# EAGLE design SmartSwitch_i2c (EAGLE 6.4)
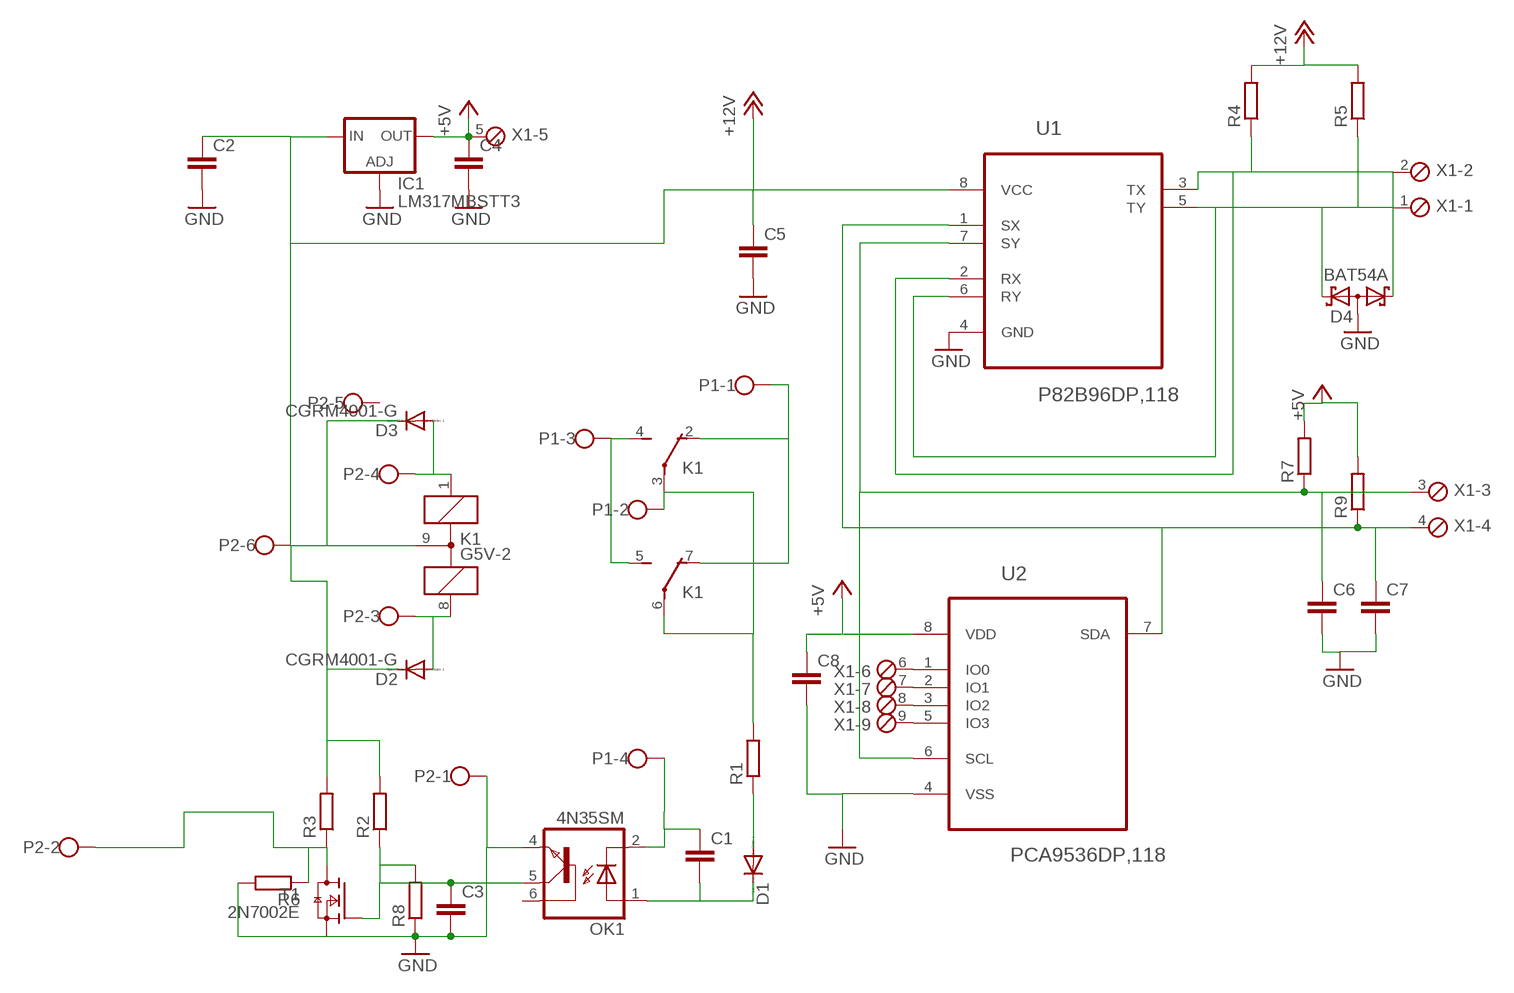
[diagram p0: schematic, sheet 1]

## Parts
C1  C-EUC0805K  [C0805K]
C2  C-EUC0805K  [C0805K]
C3  C-EUC0805K  [C0805K]
C4  C-EUC0805K  [C0805K]
C5  C-EUC0603K  [C0603K]
C6  C-EUC0402  [C0402]
C7  C-EUC0402  [C0402]
C8  C-EUC0603K  [C0603K]
D1  DIODE-DO-214AC  [DO-214AC]
D2  CGRM4001-G  [SOD-123_MINI-SMA]
D3  CGRM4001-G  [SOD-123_MINI-SMA]
D4  BAT54A  [SOT23]
IC1  LM317MBSTT3  [SOT223]
K1  G5V-2  [G5V-2]
OK1  4N35SM  [DIL6-SMD]
P1  W237-4  [W237-4]
P2  W237-6  [W237-6]
R1  R-EU_R1206  [R1206]
R2  R-EU_R0603  [R0603]
R3  R-EU_R0603  [R0603]
R4  R-EU_R1206  [R1206]
R5  R-EU_R1206  [R1206]
R6  R-EU_R0603  [R0603]
R7  R-EU_R0603  [R0603]
R8  R-EU_R0603  [R0603]
R9  R-EU_R0603  [R0603]
T1  2N7002E  [SOT23]
U1  P82B96DP,118  [SOP65P490X110-8N]
U2  PCA9536DP,118  [SOP65P490X110-8N]
X1  MPT9  [9POL254]

## Nets
+5V: C4.1 C8.1 IC1.4(OUT) R7.2 R9.2 U2.8(VDD) X1.5
+12V: C2.1 C5.1 D2.C D3.C IC1.3(IN) K1.9(M) P2.6 R2.2 R3.2 R4.2 R5.2 U1.8(VCC)
GND: C2.2 C3.2 C4.2 C5.2 C6.2 C7.2 C8.2 D4.3(A1A2) IC1.1(ADJ) OK1.4(EMI) P2.1 R6.2 R8.1 T1.2(S) U1.4(GND) U2.4(VSS)
HCL: D4.2(K2) R5.1 U1.5(TY) U1.6(RY) X1.1
HDA: D4.1(K1) R4.1 U1.2(RX) U1.3(TX) X1.2
N$1: K1.3(P) K1.6(P) P1.2 R1.2
N$2: K1.4(S) K1.5(S) P1.3
N$3: K1.2(O) K1.7(O) P1.1
N$12: D1.A R1.1
N$13: C1.2 D1.C OK1.1(A)
N$14: C1.1 OK1.2(C) P1.4
N$15: D3.A K1.1 P2.4
N$16: D2.A K1.8 P2.3
N$18: C3.1 OK1.5(COL) R2.1 R8.2 T1.1(G)
N$20: P2.2 R3.1 R6.1 T1.3(D)
N$32: U2.1(IO0) X1.6
N$33: U2.2(IO1) X1.7
N$34: U2.3(IO2) X1.8
N$35: U2.5(IO3) X1.9
SCL: C6.1 R7.1 U1.7(SY) U2.6(SCL) X1.3
SDA: C7.1 R9.1 U1.1(SX) U2.7(SDA) X1.4
Unconnected: OK1.6(BAS) P2.5

## Library data of the parts
C1-C4 = resistor:C-EU: CAPACITOR, European symbol
C5-C8 = billyInd:C-EU: CAPACITOR, European symbol
D1 = diode:DIODE-: DIODE
D2 D3 = diode:CGRM400*-G: Molded plasitc,JEDEC SOD-123/Mini SMA Source: Comchip CGRM4001-G.pdf
D4 = NXP_60_26022015:BAT54A: Schottky barrier (double) diodes Planar Schottky barrier diodes encapsulated in a SOT23 small plastic SMD package. Single diodes and double diodes with different pinning are available. AAL Eindhoven MK
IC1 = v-reg:LM317?*: 500 mA Adjustable Output Positive Voltage Regulator Source: http://www.onsemi.co.jp .. LM317M-D.PDF
K1 = relay_billy:G5V-2: OMRON PCB Relay Source: http://www.omron.com/ecb/products/pdf/en-g5v2.pdf; MPN: G5V-2 5DC; OC_FARNELL: 9949488; OC_NEWARK: 78K5703
OK1 = optocoupler:4N*?M: General Purpose 6-Pin Phototransistor Optocouplers Source: http://www.fairchildsemi.com/ds/4N/4N35-M.pdf; MF: FAIRCHILD SEMICONDUCTOR; MPN: 4N35S-M; OC_FARNELL: 1021179; OC_NEWARK: 67K2285
P1 = strip_connector_billy:W237-4: WAGO SCREW CLAMP; OC_FARNELL: unknown; OC_NEWARK: unknown
P2 = strip_connector_billy:W237-6: WAGO SCREW CLAMP; OC_FARNELL: unknown; OC_NEWARK: unknown
R1-R3 R6 R8 = resistor:R-EU_: RESISTOR, European symbol
R4 R5 R7 R9 = billyInd:R-EU_: RESISTOR, European symbol
T1 = NXP_60_26022015:2N7002: N-channel TrenchMOS FET N-channel enhancement mode Field-Effect Transistor (FET) in a plastic package using TrenchMOS technology. AAL Eindhoven MK
U1 = NXP_billy2:P82B96DP,118: Dual bidirectional bus buffer; MPN: P82B96DP,118; OC_FARNELL: 1831235; OC_NEWARK: 70R8458; PACKAGE: TSSOP-8; SUPPLIER: NXP Semiconductors
U2 = NXP_By_element14_Batch_1:PCA9536DP,118: 4-bit I2C-bus and SMBus I/O port; MPN: PCA9536DP,118; OC_FARNELL: -; OC_NEWARK: 70R6545; PACKAGE: TSSOP-8; SUPPLIER: NXP Semiconductors
X1 = con-phoenix-254:MPT9: PHOENIX CONNECTOR; OC_FARNELL: unknown; OC_NEWARK: unknown

## Board
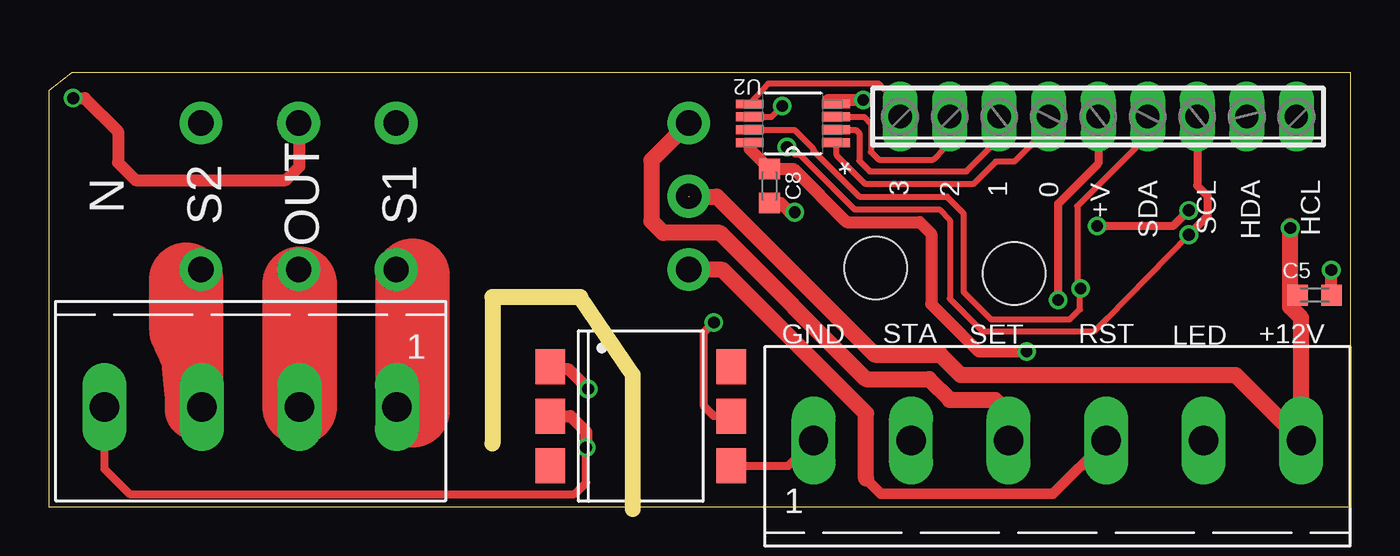
[diagram p1: board, top side]
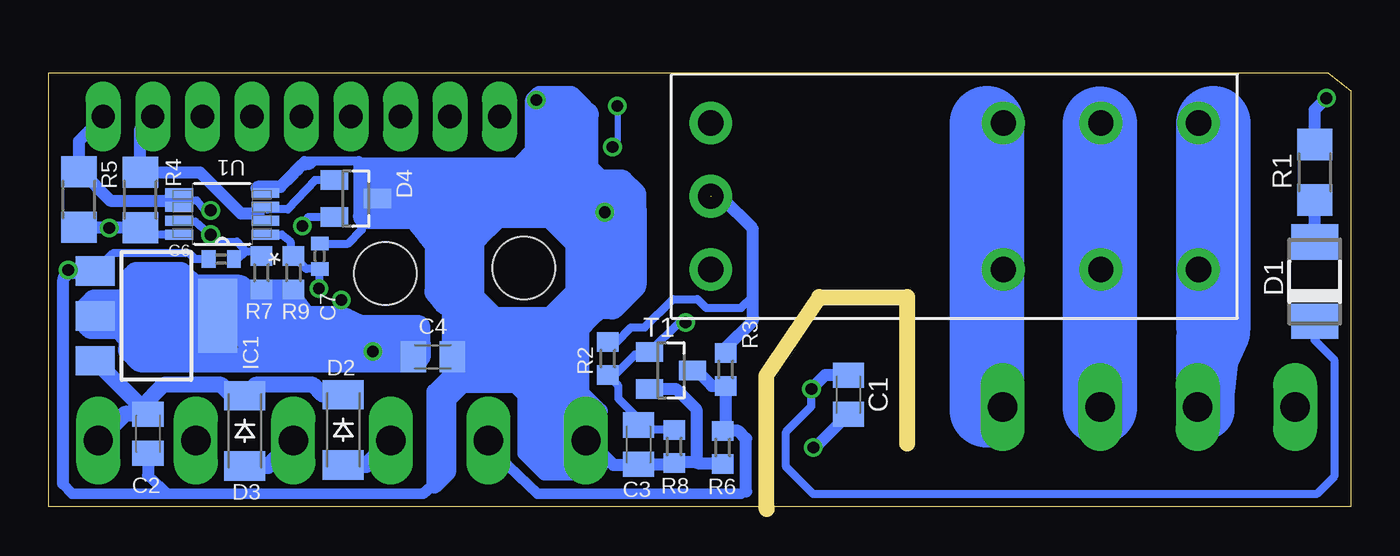
[diagram p2: board, bottom side, seen from below]

Size 66.75 x 22.25 mm. Coordinates in mm from the lower left corner, seen from the top.
Outline: 0,0 66.75,0 66.75,22.25 1.17,22.25 0,21.33 0,0
Copper layers (1*16): Top 0.0356mm / dielectric 1.5011mm / Bottom 0.0356mm
Design rules "LaenPCBOrder *": minimum track width 6mil, minimum drill 13mil, track to track 6mil, track to pad 6mil, pad to pad 6mil, via to via 6mil, smd to smd 6mil, copper to edge 15mil, drill to drill 6mil, minimum pad ring 7mil, minimum via ring 7mil, stop-mask expansion 4mil, vias tented up to drill 24mil, thermal gap 10mil
Holes 3.2 mm at 42.4,12.25 49.5,11.96
Milling: 4 lines

### Footprints (pad centres in the part's own frame; a part is rotated, then mirrored left to right if it is on the bottom)
C0805K = smd 1.3 x 1.6: 1 -1,0; 2 1,0
C0603K = smd 1.05 x 1.08: 1 -0.875,0; 2 0.875,0
C0402 = smd 0.7 x 0.9: 1 -0.65,0; 2 0.65,0
DO-214AC = smd 1.8 x 2.4: A 2.025,0; C -2.025,0
SOD-123_MINI-SMA = smd 1.5 x 2.1: A 1.8,0; C -1.8,0
SOT23 = smd 1 x 1.4: 1 -0.95,-1.1; 2 0.95,-1.1; 3 0,1.1
SOT223 = smd 1.5 x 2: 1 -2.3,-3.15; 2 0,-3.15; 3 2.3,-3.15 | smd 3.8 x 2: 4 0,3.15
G5V-2 = drill 1.3 pad 2.184: 1 0,-3.75; 2 15,-3.75; 3 20,-3.75; 4 25,-3.75; 5 25,3.75; 6 20,3.75; 7 15,3.75; 8 0,3.75; 9 0,0
DIL6-SMD = smd 1.78 x 1.52: 1 -2.54,-4.645; 2 0,-4.645; 3 2.54,-4.645; 4 2.54,4.645; 5 0,4.645; 6 -2.54,4.645
W237-4 = drill 1.5 long: 1 -7.5,-1.27; 2 -2.5,-1.27; 3 2.5,-1.27; 4 7.5,-1.27
W237-6 = drill 1.5 long: 1 -12.5,-1.27; 2 -7.5,-1.27; 3 -2.5,-1.27; 4 2.5,-1.27; 5 7.5,-1.27; 6 12.5,-1.27
R1206 = smd 1.6 x 1.803: 1 -1.422,0; 2 1.422,0
R0603 = smd 1 x 1.1: 1 -0.85,0; 2 0.85,0
SOP65P490X110-8N = smd 1.422 x 0.508: 1 -2.21,1.067; 2 -2.21,0.356; 3 -2.21,-0.356; 4 -2.21,-1.067; 5 2.21,-1.067; 6 2.21,-0.356; 7 2.21,0.356; 8 2.21,1.067
SOP65P490X110-8N' = smd 1.422 x 0.457: 1 -2.21,0.991; 2 -2.21,0.33; 3 -2.21,-0.33; 4 -2.21,-0.991; 5 2.21,-0.991; 6 2.21,-0.33; 7 2.21,0.33; 8 2.21,0.991
9POL254 = drill 1.2 long: 1 -10.16,0; 2 -7.62,0; 3 -5.08,0; 4 -2.54,0; 5 0,0; 6 2.54,0; 7 5.08,0; 8 7.62,0; 9 10.16,0

### Placement (x,y rotation side)
C1  25.75,5.75 90 bottom
C2  61.66,3.75 270 bottom
C3  36.51,3.19 270 bottom
C4  47.06,7.69 0 bottom
C5  64.9,10.86 0 top
C6  57.9,12.7 180 bottom
C7  52.86,12.85 90 bottom
C8  36.95,16.45 270 top
D1  1.85,11.55 90 bottom
D2  51.65,3.95 270 bottom
D3  56.7,3.9 270 bottom
D4  51.01,15.8 270 bottom
IC1  61.23,9.79 270 bottom
K1  32.81,15.92 0 bottom
OK1  30.35,4.65 270 top
P1  10.35,3.85 180 top
P2  51.71,4.67 0 top
R1  1.85,17.15 90 bottom
R2  38.1,7.6 90 bottom
R3  32.05,7.05 90 bottom
R4  62.05,15.73 270 bottom
R5  65.2,15.75 270 bottom
R6  32.2,3.05 270 bottom
R7  55.85,12 270 bottom
R8  34.69,3.1 90 bottom
R9  54.2,12 270 bottom
T1  34.85,7 270 bottom
U1  57.85,15.02 180 bottom
U2  PCA9536DP,118  [SOP65P490X110-8N']  38.15,19.66 180 top
X1  53.8,20 180 top

### Tracks (layer width: path | path; a pad name or v marks a point on that pad's centre or on a via)
+5V  (via drill 0.6)
  Top 0.406: X1.5 53.8,17.6 51.75,15.55 v51.75,10.6 | U2.8 35.94,18.48
  Top 0.61: 35.94,18.48 35.94,18.34 C8.1 38.17,17.32 40.9,14.6 44.65,14.6 45.25,14 45.25,10.4 47.69,7.96 v50.14,7.96
  Bottom 0.406: R9.2 R7.2 56.72,11.15 IC1.4 | 51.65,8.95 52.3,8.3 | v51.75,10.6 51.75,8.98 51.93,8.8
  Bottom 0.61: v50.14,7.96 53.3,8.3 | R9.2 54.45,11
  Bottom 0.813: C4.1 v50.14,7.96 52.3,8.3 53.3,8.3 56.59,8.3 IC1.4
  Bottom 1.27: 54.45,11 56.65,11 56.95,11.1 56.95,11.25 59.35,11.25 60,11.9 62.25,11.9 62.4,11.75 62.4,11 62.9,10.5 64.4,10.5 64.75,10.15 64.75,9.45 64.55,9.25 63.15,9.25 62.55,8.65 62.55,8.05 62.05,7.55 48,7.55 47.8,7.75 47.82,9.19 47.96,9.18 50.91,9.18 49.12,8.94 50.84,9.2 51.6,9.57 51.95,9.63 52.15,9.65 53.6,9.65 54.2,10.45 56.5,10.55 56.7,10.35 56.7,9.55 56.3,9.15 48.95,9.15 48.6,8.8 51.93,8.8 53.85,8.8 54.7,9.65 56.15,9.65 56.2,9.7 59.15,9.7 60.45,11 59.65,11 59.1,10.45 61.1,10.45 61.6,10.95 61.8,10.95 62.75,10 62.75,9.6 61.75,8.6 59.5,8.6 59.2,8.3 59.2,8.4 60.4,9.6 61.25,9.6 61.5,9.85
+12V  (via drill 0.6)  (1 unrouted)
  Top 0.61: v63.65,14.3 63.5,14.25 | C5.1 63.65,10.86 63.65,11.08
  Top 0.813: P2.6 64.21,3.59 | P2.6 64.21,9.69 63.65,10.25 63.65,11.08 v63.65,14.3 63.65,14.39 | 32.83,15.9 34.25,15.9 42.35,7.8 45.72,7.8 46.75,6.77 60.84,6.77 P2.6
  Bottom 0.406: R2.2 37.65,8.45 36.9,9.2 36.2,9.2 34.75,10.65 33.5,10.65 33.05,10.2 31.25,10.2 30.65,10.8 | U1.8 61.85,13.95 R4.2
  Bottom 0.61: R3.2 32.05,8.15 30.65,9.55 30.65,10.8 30.65,14.25 32.25,15.85 32.74,15.85 K1.9 | R5.2 63.43,14.33 v63.65,14.3 63.29,14.31 R4.2
  Bottom 0.813: C2.1 61.66,4.77 | 61.66,4.77 61.99,5.11 | 61.99,5.11 IC1.3 | 61.66,4.77 62.84,4.77 P2.6 | 61.99,5.11 60.85,6.25 57.9,6.25 57.35,5.7 D3.C 56.15,6.25 53.2,6.25 52.7,5.75 D2.C
GND  (via drill 0.6)
  Top 0.305: 39.95,20.85 40.61,20.9 U2.4
  Top 0.406: OK1.4 37.92,2.11 P2.1
  Top 0.61: C8.2 37.52,15.57 38,15.1 v38.25,15.1 | v41.75,20.85 39.95,20.85 | C5.2 65.75,10.86 v65.75,12.15
  Bottom 0.305: 47.3,14.05 47.31,14.7 48.53,15.21 | 53.75,17.53 53.85,17.53 53.86,17.54
  Bottom 0.406: C6.2 59.25,12.7 59.55,13 63.47,13 IC1.1 | 55.62,16.19 U1.4 56.01,16.35 56.1,16.35 | C7.2 51.4,13.5 50.7,14.2 50.7,14.86 | 50.7,14.86 50.69,14.87 | 50.69,14.87 50.61,14.95 D4.3 | 41.3,20.85 40.3,19.85 | 45.61,7.83 45.67,7.83 45.67,7.75 | 47.65,14.85 50.71,14.85 50.73,14.87 50.69,14.87 | 50.69,14.87 50.69,14.89 50.33,14.89 50.01,15.21 | 50.7,14.86 50.38,14.86 50.03,15.21 50.03,15.23 50.05,15.23 50.07,15.21 50.07,15.77 49.51,16.33 49.51,15.71 50.01,15.21 | 50.01,15.21 50.05,15.21 50.07,15.19 50.07,15.17 50.05,15.15
  Bottom 0.457: 49.95,16.7 50.85,17.75 53.65,17.75 53.86,17.54 54,17.4 54,17.28
  Bottom 0.55: 61.66,1.61 60.65,0.68 | 60.65,0.68 47.55,0.68 46.55,1.55 | 66.03,1.2 65.55,0.68 60.65,0.68
  Bottom 0.61: P2.1 39.05,3.4 37.8,2.15 36.55,2.15 C3.2 34.75,2.19 R8.1 34.64,2.3 33.55,2.3 | T1.2 34.6,6.05 33.55,5 33.55,2.3 | 33.55,2.3 33.5,2.25 32.25,2.25 R6.2 | C2.2 61.66,1.61 | 65.61,12.09 66,11.7 | 66.03,1.2 66.03,11.55 66,11.7 | v65.75,12.15 66,11.7 | 49.95,16.7 49.75,15.89 D4.3 | 56.1,16.35 56.05,16.4 54.88,16.4 54,17.28 | 54.56,16.72 53.75,17.53 53.45,17.58 53.34,17.63
  Bottom 0.813: 46.55,1.55 46.55,5.2 | 46.55,5.2 45.5,6.25 42.06,6.25 P2.1 | IC1.1 65.61,12.09 | 46.55,5.2 45.93,7.85 45.61,7.83 C4.2 45.05,9.94 | 49.75,15.89 48.53,15.21 46.9,13.2 | v41.75,20.85 41.3,20.85 | 42.33,6.29 42.33,2.77 41.33,1.77 38.83,1.77 38.51,2.09 38.51,4.91 39.45,5.85 39.45,4.11 39.11,3.77 39.11,2.63 39.01,2.53 41.05,2.53 41.17,2.41 40.25,2.41 39.65,3.01 39.65,8.91 38.69,9.87 38.69,12.29 41.31,14.91 43.49,14.91 44.97,13.43 44.97,10.95 43.87,9.85 44.63,9.85 45.63,10.85 45.63,13.77 43.97,15.43 43.97,16.19 41.91,18.25 41.91,20.87 41.61,21.17 39.95,21.17 39.29,20.51 39.45,20.51 42.47,17.49 50.73,17.49 50.73,14.97 | 50.73,14.97 50.73,14.87 50.73,14.81 50.59,14.67 47.83,14.67 47.65,14.85 | 50.73,14.97 50.61,14.95 | 50.61,14.95 47.73,14.95 47.67,15.09 50.49,15.09 50.61,14.95 | 50.73,14.97 47.29,14.97 46.61,14.15 46.61,11.05 46.27,10.71 46.27,10.43 46.19,10.35 46.19,5.77 46.29,5.67 46.29,1.77 46.97,1.09 46.97,5.91 45.93,6.95
  Bottom 1.016: 45.27,7.75 45.67,7.75 45.75,7.75 45.75,6.45
  Bottom 1.27: v38.25,15.1 37.2,15.1 36.75,15.55 36.75,16 37.4,16.65 38.55,16.65 39.2,17.3 39.2,20.1 39.65,20.55 41.1,20.55 41.35,20.3 41.35,18.5 42.8,17.05 50,17.05 50,15 49.65,15.02 45.45,14.75 45.25,14.95 46.65,14.95 47.25,15.55 47.3,14.05 46.85,13.5 46.85,11.05 46.35,10.45 45.6,10.45 45.05,11 45.05,13.65 43.9,14.95 40.95,14.95 40.2,14.15 40.15,14.15 39.65,13.65 39.65,10.95 41,9.6 44,9.6 45,10.6 45.6,10.6 46.05,11.05 46.05,14.3 44.45,15.9 48.65,15.9 49.15,16 42.55,15.95 40.3,18.2 | 40.3,18.2 40.3,19.85 | 40.3,18.2 40.3,17.5 40.05,17.25 40,17.25 38.65,15.9 | 38.65,15.9 37.8,15.9 | 38.65,15.9 39.8,15.9 40.7,16.8 40.95,16.8 41.8,15.95 40.8,15.95 40.45,15.6 37.65,15.6 37.2,15.15 36.9,15.15 36.75,15.3 36.75,11.35 37.85,10.25 38.75,10.25 39.4,9.6 39.4,9.75 37.8,11.35 37.8,13.9 37.5,14.2 38.7,14.2 39.2,14.7 39.9,14.7 39.95,14.75 39.95,14.7 38.5,13.25 38.5,12.05 39.1,11.45 39.1,9.8 39.95,8.95 39.95,9 39.7,9.25 39.7,5.6 39.2,5.1 39.2,4.45 40.7,2.95 41.85,2.95 41.85,5.6 43.4,7.15 44.9,7.15 45.05,7 45.05,8.55 44.4,9.2 41.25,9.2 40.85,8.8 40.85,5.85 40.1,5.1 40.2,5.1 43.2,8.1 | 43.2,8.1 44,8.1 | 43.2,8.1 41.95,8.1 41.9,8.15 41.9,7.85 41.55,7.5 41.55,4.45 40.95,3.85 40.95,5.15 44.45,8.65 44.7,8.4 44.7,9.2 46.3,10.8 46.05,10.8 | 46.05,10.8 46,10.8 | 46,10.8 45.95,10.75 46,10.75 46.05,10.8 | 46,10.8 45.75,10.8 45.75,7.97 45.61,7.83
HCL  (via drill 0.6)
  Top 0.406: v53.75,14.4 57.65,14.4 v58.45,15.2
  Bottom 0.406: 60.7,15.65 60.4,15.65 U1.5 U1.6 59.81,15.7 59.15,15.7 58.75,15.2 v58.45,15.2 | D4.2 53.45,14.85 v53.75,14.4
  Bottom 0.61: 60.7,15.65 60.75,15.7 63.6,15.7 65.07,17.17 R5.1 65.2,18.76 X1.1
HDA
  Bottom 0.406: 56.15,15 55.99,15 | 55.99,15 U1.3 55.54,15.25 54.5,15.25 53.1,16.75 D4.1 | U1.2 55.68,14.69 55.99,15
  Bottom 0.61: 56.15,15 56.2,15.05 56.9,15.05 59,17.15 R4.1 62.05,19.37 X1.2
N$1  (via drill 0.6)
  Top 0.61: v1.25,20.95 1.85,20.95 3.55,19.25 3.55,17.65 4.45,16.75 12.15,16.75 12.85,17.45 12.85,19.63 K1.6
  Top 3.81: P1.2 12.85,11.45
  Bottom 0.61: R1.2 1.85,20.35 v1.25,20.95
  Bottom 1.27: K1.6 12.83,19.67 12.85,19.65 | K1.3 12.61,11.89 12.85,11.65
  Bottom 3.81: 12.85,19.65 12.85,11.65 P1.2
N$2
  Top 0.254: 5.65,8.55 6.08,8.55 6.1,8.53 | 6.85,8.75 6.85,9.05 7.05,9.25
  Top 0.61: 6.05,9.05 6.55,9.05 6.65,8.95 | 6.15,7.95 6.15,7.98 6.16,7.99
  Top 0.813: P1.3 7.45,5.12 7.45,4.95 | 6.35,5.75 6.15,7.95 | 6.15,7.95 6.1,8.53 6.05,9.05 | 5.65,8.55 6.65,6.35 | 6.05,7.95 6.15,7.95
  Top 1.016: 6.85,8.75 6.85,9.85 6.65,10.05
  Top 1.27: 7.05,11.65 7.29,11.65 K1.4
  Top 3: 7.45,4.95 7.45,8.95 7.15,9.25 7.05,9.25 | 6.65,10.05 6.65,8.95 6.85,8.75
  Top 3.81: 7.05,9.25 7.05,11.65
  Bottom 0.61: 7.05,9.05 7.05,9.01 6.82,8.78 | 6.15,7.85 6.15,7.88 6.16,7.88 6.16,8.58 6.65,9.07 | 6.75,6.15 6.75,6.25 6.65,6.35 | 6.35,5.95 6.35,5.92 6.34,5.9
  Bottom 0.813: 5.65,8.75 5.65,8.55 6.71,6.23 6.75,6.15 | 6.15,7.85 6.35,5.95
  Bottom 1.016: 6.65,8.95 6.65,6.29 6.71,6.23 | 6.65,10.05 6.65,8.95 | 6.65,8.95 6.85,8.75
  Bottom 1.676: 7.45,5.45 7.52,5.45 P1.3 | K1.5 7.05,19.67
  Bottom 3: 7.05,9.25 7.05,9.05 7.45,8.65 7.45,5.45 7.45,4.95 | 6.65,11.35 6.65,10.05 6.65,9.07 6.65,8.95 6.82,8.78 6.85,8.75 7.05,8.55
  Bottom 3.81: 7.05,19.67 7.05,9.25
N$3
  Top 0.406: P1.1 18.55,5.12 18.55,5.15 18.65,5.15
  Top 0.813: K1.2 17.95,12.17 17.95,5.05 18.15,5.05 18.15,12.15
  Top 1.016: 18.65,11.85 17.81,11.85 K1.2
  Top 3.81: 18.65,4.95 18.65,5.15 18.65,11.85
  Bottom 0.813: K1.7 18.65,19.67 | 18.65,4.95 17.81,4.95 K1.2
  Bottom 3.81: 18.65,19.67 18.65,4.95
N$12
  Bottom 0.61: D1.A R1.1
N$13  (via drill 0.6)
  Top 0.61: v27.65,6.05 26.65,7.05 25.84,7.05 OK1.1
  Bottom 0.406: D1.C 1.85,8.55 0.85,7.55 0.85,1.55 1.75,0.65 27.55,0.65 28.95,2.05 28.95,3.85 27.65,5.15 v27.65,6.05
  Bottom 0.61: C1.2 26.95,6.75 v27.65,6.05
N$14  (via drill 0.6)
  Top 0.406: P1.4 2.85,1.95 4.15,0.65 26.95,0.65 27.55,1.25 v27.55,3.05
  Top 0.61: OK1.2 26.75,4.65 27.55,3.85 v27.55,3.05
  Bottom 0.61: v27.55,3.05 27.45,3.05 C1.1
N$15
  Top 0.55: 41.9,1.45 42.67,0.68 51.49,0.68 P2.4
  Top 0.813: 41.9,1.45 41.9,4.8 34.55,12.15 32.83,12.15 K1.1
  Bottom 0.813: D3.A 55.51,2.1 P2.4
N$16
  Top 0.813: K1.8 30.9,17.76 30.9,14.65 31.5,14.05 34.4,14.05 41.9,6.55 45.13,6.55 46.19,5.49 48.51,5.49 49.2,4.8 P2.3
  Bottom 0.813: D2.A 50.46,2.15 P2.3
N$18  (via drill 0.6)
  Top 0.406: OK1.5 34.1,4.65 33.6,5.15 33.6,8.95 v34.1,9.45
  Bottom 0.406: R8.2 36.27,3.95 C3.1 36.51,4.51 37.55,5.55 37.55,6.2 R2.1 37.75,6.75 36.7,7.8 36.1,7.8 T1.1 34.45,9.45 v34.1,9.45
N$20
  Bottom 0.55: 44.21,3.06 41.7,0.68 31.25,0.68 31,0.8
  Bottom 0.61: T1.3 33.55,7 32.75,6.2 R3.1 32.05,4.05 R6.1 31.4,3.9 31,3.5 31,0.8 | P2.2 44.21,3.06
N$32
  Top 0.305: X1.6 51.26,19.46 49.5,17.7 48.55,17.7 47.4,16.55 41.87,16.55 40.39,18.03 40.39,18.64 U2.1
N$33
  Top 0.305: U2.2 41.37,19.33 41.55,19.15 41.55,17.75 42.1,17.2 47.05,17.2 48.4,18.55 48.4,19.68 X1.7
N$34
  Top 0.305: U2.3 41.81,19.99 42.15,19.65 42.15,18.2 42.55,17.8 45.35,17.8 45.95,18.4 45.95,19.77 X1.8
N$35
  Top 0.305: X1.9 43.64,20.51 42.55,21.7 36.89,21.7 U2.5
SCL  (via drill 0.6)
  Top 0.305: U2.6 37.04,19.99 v37.6,20.55 | 54.05,9.45 54.27,9.68 | 54.27,9.68 v58.45,13.95 | v37.85,18.45 38.25,18.05 38.51,18.05 41.31,15.25 45.65,15.25 46.2,14.7 46.2,10.68 47.87,9.01 53.6,9.01 54.27,9.68
  Top 0.406: X1.3 58.88,16.47 59.4,15.95 59.4,14.9 v58.45,13.95
  Bottom 0.305: v37.6,20.55 37.6,18.5 v37.85,18.45
  Bottom 0.406: U1.7 59.24,14.64 v58.45,13.95 58.1,13.6 57.1,13.6 56.65,13.1 | 56.65,13.1 56.15,13.1 R7.1 | C6.1 57.3,12.7 57.35,12.65 57.15,12.65 56.65,13.1
SDA  (via drill 0.6)
  Top 0.305: U2.7 38.22,19.33 39.2,18.35 39.2,18.25 41.55,15.9 46.05,15.9 46.9,15.05 46.9,11.02 48.31,9.61 52.35,9.61 52.87,10.13 52.87,11.16 v52.9,11.19 52.73,11.36 52.73,15.41 56.21,18.89 56.21,19.87 X1.4
  Bottom 0.406: U1.1 54.8,13.95 54.35,13.6 54.35,13 R9.1 53.55,12.2 53.13,12.2 | C7.1 53.13,12.2 | 53.13,12.2 52.9,11.97 v52.9,11.19

### Text on the board
tPlace: N | S2 | S1 | OUT
tNames: 3 | 2 | 1 | 0 | +V | SDA | SCL | HDA | HCL | GND | STA | SET | RST | LED | +12V